# Altium schematic sheet Isolator_Spi.SchDoc
size A4; SheetNumber: 14; SheetTotal: 16
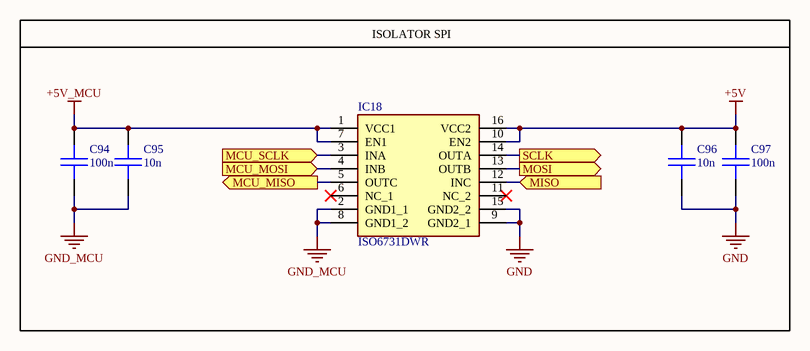
[diagram p0: Isolator_Spi.SchDoc]

## Parts
C94  100n  [C_0603]
C95  10n  [C_0603]
C96  10n  [C_0603]
C97  100n  [C_0603]
IC18  ISO6731DWR  [SOIC127P1030X265-16N]

## Blocks framed on the sheet
ISOLATOR SPI: C94-C97 IC18

## Ports
MCU_MISO (out, see Interconnections[5C], Microcontroller[4B]), MCU_MOSI (in, see Interconnections[5C], Microcontroller[4B]), MCU_SCLK (in, see Interconnections[5C], Microcontroller[4B]), MISO (in, see Interconnections[4C], AD_Converter[5A]), MOSI (out, see Interconnections[4C], AD_Converter[5A]), SCLK (out, see Interconnections[4C], AD_Converter[5A])

## Nets
+5V: C96.2 C97.2 IC18.10(EN2) IC18.16(VCC2)
+5V_MCU: C94.2 C95.2 IC18.1(VCC1) IC18.7(EN1)
GND: C96.1 C97.1 IC18.9(GND2_1) IC18.15(GND2_2)
GND_MCU: C94.1 C95.1 IC18.2(GND1_1) IC18.8(GND1_2)
MCU_MISO: IC18.5(OUTC) ; port MCU_MISO
MCU_MOSI: IC18.4(INB) ; port MCU_MOSI
MCU_SCLK: IC18.3(INA) ; port MCU_SCLK
MISO: IC18.12(INC) ; port MISO
MOSI: IC18.13(OUTB) ; port MOSI
SCLK: IC18.14(OUTA) ; port SCLK

Not connected (* = marked no-connect by the designer): IC18 6(NC_1)* 11(NC_2)*

## Library data of the parts
C94-C97 = CAP: SMD Chip Capacitor
IC18 = ISO6731DWR: Integrated Circuit; Manufacturer_Name: Texas Instruments; Datasheet Link: https://www.ti.com/lit/ds/symlink/iso6731.pdf?ts=1623477624400&ref_url=https%253A%252F%252Fwww.ti.com%252Fstore%252Fti%252Fen%252Fp%252Fproduct%252F%253Fp%253DISO6731DWR%2526keyMatch%253DISO6731DWR%2526tisearch%253Dsearch-everything%2526usecase%253DOPN; Height: 2.65mm; Manufacturer_Part_Number: ISO6731DWR; Mouser Part Number: 595-ISO6731DWR; Mouser Price/Stock: https://www.mouser.co.uk/ProductDetail/Texas-Instruments/ISO6731DWR?qs=iLbezkQI%252Bsg6BfGQOcJxyQ%3D%3D